# EAGLE design Module_MCU_M5Stack (EAGLE 9.6.2)
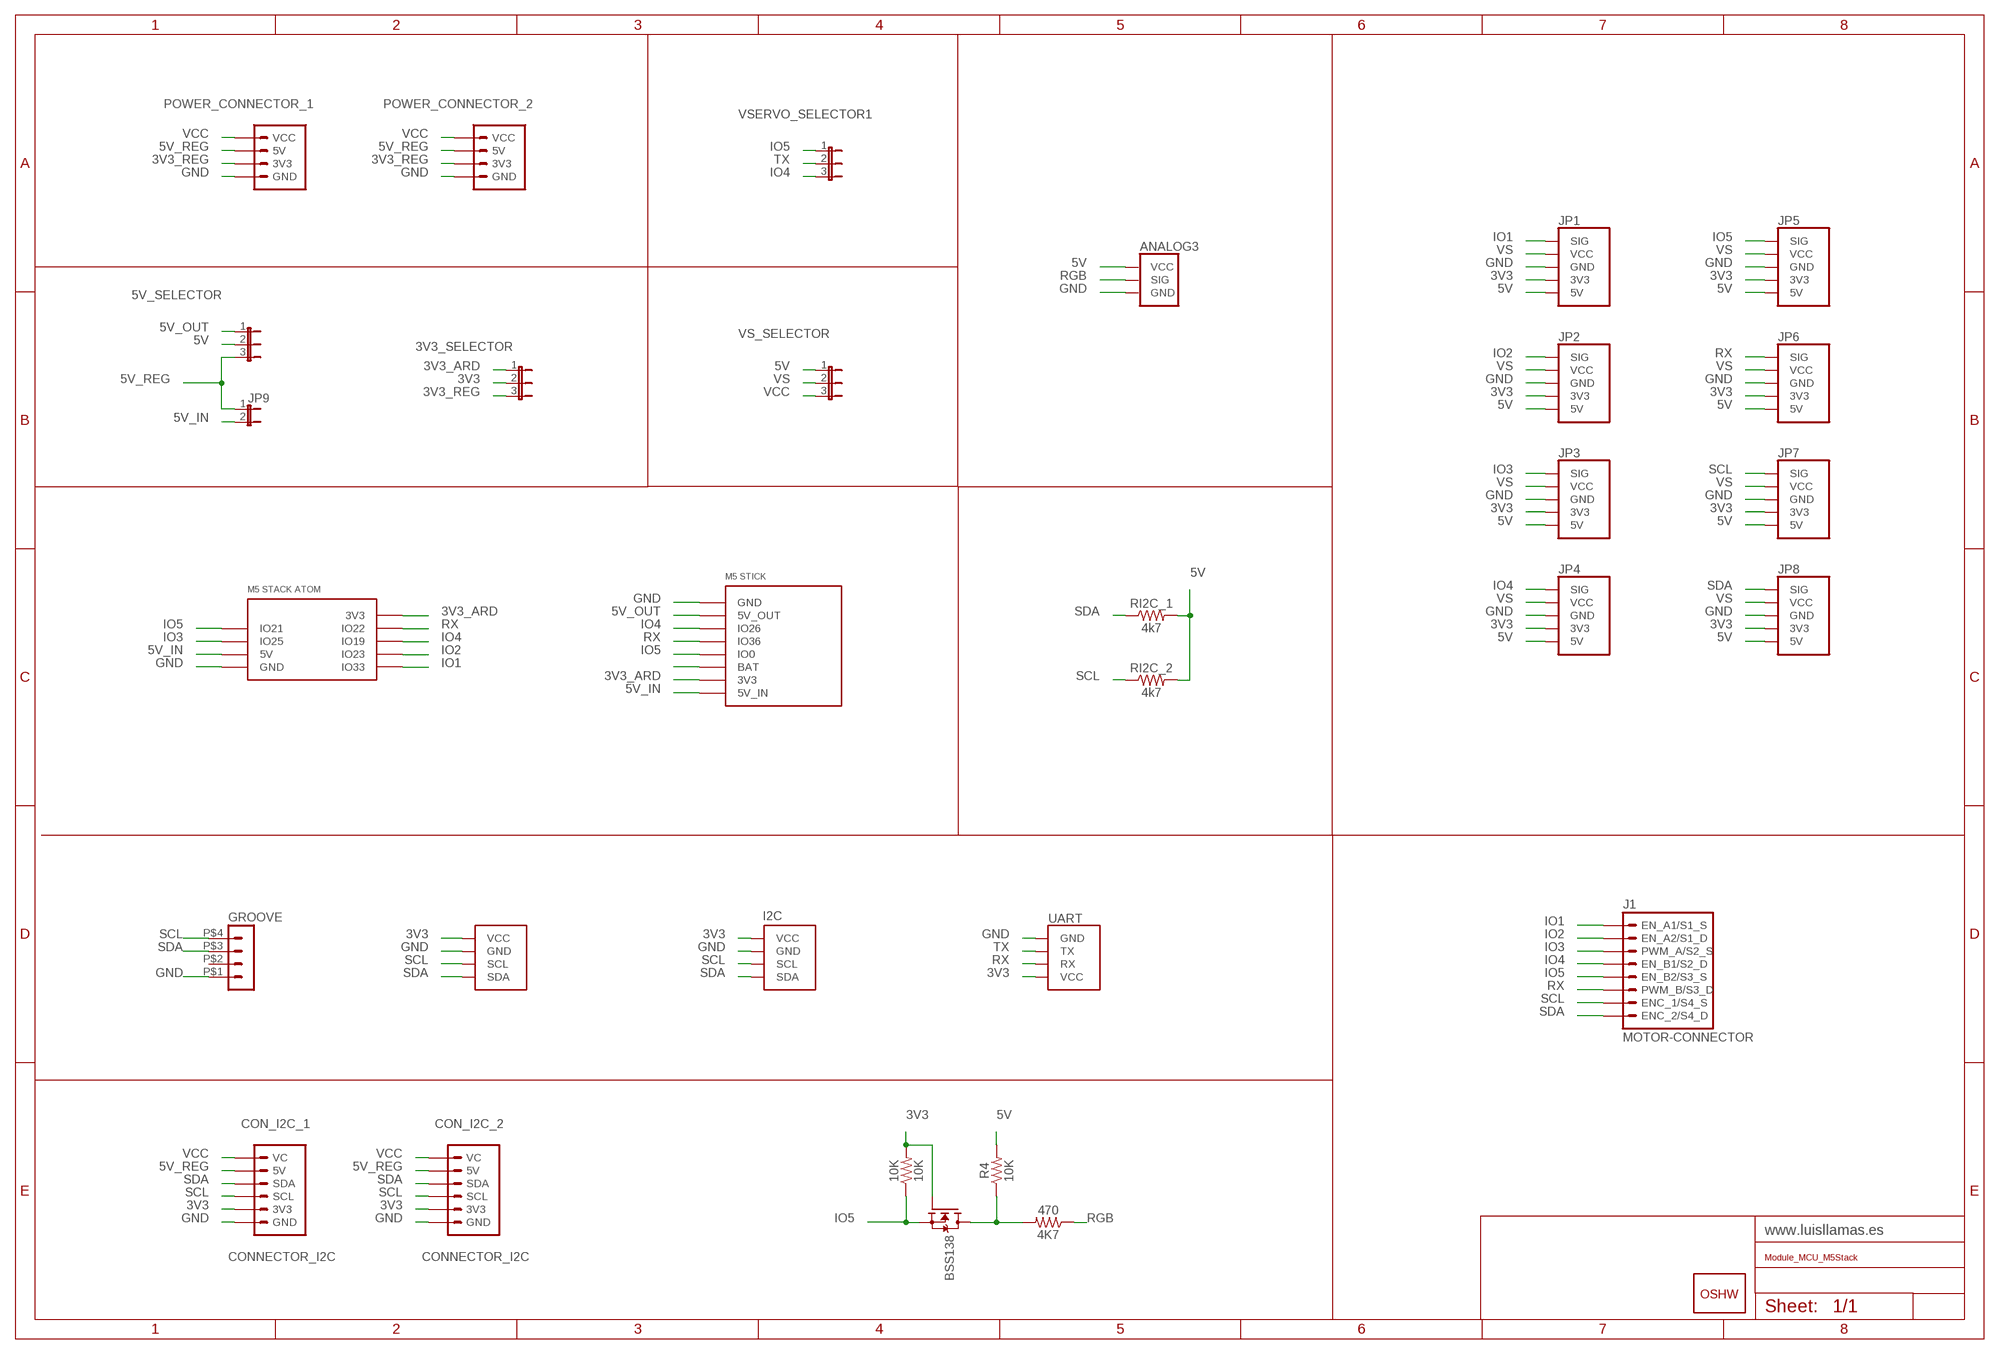
[diagram p0: schematic, sheet 1]

## Parts
3V3_SELECTOR  JUMPER_3  [JUMPER_3]
4K7  470  RESISTOR0805  [0805]
5V_SELECTOR  JUMPER_3  [JUMPER_3]
10K  10K  RESISTOR0805  [0805]
ANALOG3  LDR/OCT  [LDR]
BSS138  MOSFET-N-SOT23  [SOT23]
CON_I2C_1  CONNECTOR_I2C  [CONNECTOR_I2C]
CON_I2C_2  CONNECTOR_I2C  [CONNECTOR_I2C]
GOLD_ORB_SM1  OSHWLOGO_GOLD_ORB_MED  [OSHW1]
GROOVE  GROOVE  [GROOVE]
I2C_1  I2C  GENERIC_I2CVCC_GND_SCL_SDA  [I2C_VCC_GND_SCL_SDA]
I2C_2  GENERIC_I2CVCC_GND_SCL_SDA  [I2C_VCC_GND_SCL_SDA]
J1  MOTOR-CONNECTOR  [MOTOR-CONNECTOR]
JP1  SERVO_5  [SERVO_5]
JP2  SERVO_5  [SERVO_5]
JP3  SERVO_5  [SERVO_5]
JP4  SERVO_5  [SERVO_5]
JP5  SERVO_5  [SERVO_5]
JP6  SERVO_5  [SERVO_5]
JP7  SERVO_5  [SERVO_5]
JP8  SERVO_5  [SERVO_5]
JP9  JUMPER_2PTH  [JUMPER_2]
POWER_CONNECTOR_1  POWER-CONNECTOR  [POWER-CONNECTOR]
POWER_CONNECTOR_2  POWER-CONNECTOR  [POWER-CONNECTOR]
R4  10K  RESISTOR0805  [0805]
RI2C_1  4k7  RESISTOR1206  [1206]
RI2C_2  4k7  RESISTOR1206  [1206]
U$1  M5-STACK-ATOM  [M5-STACK-ATOM]
U$2  M5-STICK  [M5-STICK]
UART  UART  GENERIC_UARTGND_TX_RX_VCC  [GENERIC_UART]
VS_SELECTOR  JUMPER_3  [JUMPER_3]
VSERVO_SELECTOR1  JUMPER_3  [JUMPER_3]

## Nets
3V3: 3V3_SELECTOR.2 10K.2 BSS138.1(G) CON_I2C_1.3V3 CON_I2C_2.3V3 I2C_1.VCC I2C_2.VCC JP1.3V3 JP2.3V3 JP3.3V3 JP4.3V3 JP5.3V3 JP6.3V3 JP7.3V3 JP8.3V3 UART.VCC
3V3_ARD: 3V3_SELECTOR.1 U$1.3V3 U$2.3V3
3V3_REG: 3V3_SELECTOR.3 POWER_CONNECTOR_1.3V3 POWER_CONNECTOR_2.3V3
5V: 5V_SELECTOR.2 ANALOG3.VCC JP1.5V JP2.5V JP3.5V JP4.5V JP5.5V JP6.5V JP7.5V JP8.5V R4.2 RI2C_1.2 RI2C_2.2 VS_SELECTOR.1
5V_IN: JP9.2 U$1.5V U$2.5V_IN
5V_OUT: 5V_SELECTOR.1 U$2.5V_OUT
5V_REG: 5V_SELECTOR.3 CON_I2C_1.5V CON_I2C_2.5V JP9.1 POWER_CONNECTOR_1.5V POWER_CONNECTOR_2.5V
GND: ANALOG3.GND CON_I2C_1.GND CON_I2C_2.GND GROOVE.P$1 I2C_1.GND I2C_2.GND JP1.GND JP2.GND JP3.GND JP4.GND JP5.GND JP6.GND JP7.GND JP8.GND POWER_CONNECTOR_1.GND POWER_CONNECTOR_2.GND U$1.GND U$2.GND UART.GND
IO1: J1.EN_A1/S1_S JP1.SIG U$1.IO33
IO2: J1.EN_A2/S1_D JP2.SIG U$1.IO23
IO3: J1.PWM_A/S2_S JP3.SIG U$1.IO25
IO4: J1.EN_B1/S2_D JP4.SIG U$1.IO19 U$2.IO26 VSERVO_SELECTOR1.3
IO5: 10K.1 BSS138.2(S) J1.EN_B2/S3_S JP5.SIG U$1.IO21 U$2.IO0 VSERVO_SELECTOR1.1
N$9: 4K7.2 BSS138.3(D) R4.1
N$15: U$2.BAT
RGB: 4K7.1 ANALOG3.SIG
RX: J1.PWM_B/S3_D JP6.SIG U$1.IO22 U$2.IO36 UART.RX
SCL: CON_I2C_1.SCL CON_I2C_2.SCL GROOVE.P$4 I2C_1.SCL I2C_2.SCL J1.ENC_1/S4_S JP7.SIG RI2C_2.1
SDA: CON_I2C_1.SDA CON_I2C_2.SDA GROOVE.P$3 I2C_1.SDA I2C_2.SDA J1.ENC_2/S4_D JP8.SIG RI2C_1.1
TX: UART.TX VSERVO_SELECTOR1.2
VCC: CON_I2C_1.VC CON_I2C_2.VC POWER_CONNECTOR_1.VCC POWER_CONNECTOR_2.VCC VS_SELECTOR.3
VS: JP1.VCC JP2.VCC JP3.VCC JP4.VCC JP5.VCC JP6.VCC JP7.VCC JP8.VCC VS_SELECTOR.2
Unconnected: GROOVE.P$2

## Library data of the parts
3V3_SELECTOR 5V_SELECTOR VS_SELECTOR VSERVO_SELECTOR1 = LLL_Jumpers:JUMPER_3
4K7 10K R4 RI2C_1 RI2C_2 = SparkFun-Resistors:RESISTOR: Generic Resistor Package
ANALOG3 = LLL_Headers:LDR: Header for LDR
BSS138 = we-transistor:MOSFET-N: N-Channel MOSFET SOT23 N-Chn MOSFET TSM3404, TSM240N03 (Vgs>=+/-20V, Vds<=30V, Id>=3A + Rds<=0.05Ohm @ Vgs=4.5V) BSS138 (Vgs>=+/-20V, Vds<=40V, Id>=0.2A + Rds<=3Ohm @ Vgs=4.5V) SOT223 Low Side Switch with Protection (Infineon) BSP76 (Vin=0...10V, Vds<=42V, Id=1.4A + Rds=0.2Ohm @ Vin=5V) BSP77 (Vin=0...10V, Vds<=42V, Id=2.2A + Rds=0.1Ohm @ Vin=5V) D²Pak Low Side Switch with Protection (Infineon) BTS117TC (Vin=0...10V, Vds<=60V, Id=3.5A + Rds=0.12Ohm @ Vin=5V) BTS133TC (Vin=0...10V, Vds<=60V, Id=7A + Rds=0.06Ohm @ Vin=5V) BTS141TC (Vin=0...10V, Vds<=60V, Id=12A + Rds=0.03Ohm @ Vin=5V) BTS3018TC (Vin=0...10V, Vds<=60V, Id=6A + Rds=0.02Ohm @ Vin=5V)
CON_I2C_1 CON_I2C_2 = LLL_Connectors:CONNECTOR_I2C
GOLD_ORB_SM1 = LLL_Frames:OSHWLOGO: These are Open-Source Hardware logos.
GROOVE = LLL_Connectors:GROOVE: JST Connector
I2C_1 I2C_2 = LLL_Headers:GENERIC_I2C
J1 = LLL_Motors:MOTOR-CONNECTOR: MOTOR CONNECTOR 8p DC Motor EN_A1 EN_A2 PWM_A EN_B1 EN_B2 PWM_B ENC_1 ENC_2 Stepper STEP1_S STEP1_D STEP2_S STEP2_D STEP3_S STEP3_D STEP4_S STEP4_D
JP1-JP8 = LLL_Headers:SERVO_5: Header for servo
JP9 = LLL_Jumpers:JUMPER_2: Jumper Basic 0.1" spaced jumper. Use with breakaway headers.
POWER_CONNECTOR_1 POWER_CONNECTOR_2 = LLL_Power:POWER-CONNECTOR: JST Connector
U$1 = LLL_ESP32:M5-STACK-ATOM
U$2 = LLL_ESP32:M5-STICK
UART = LLL_Headers:GENERIC_UART

## Net classes
0 default: clearance 0.205 mm

## Board
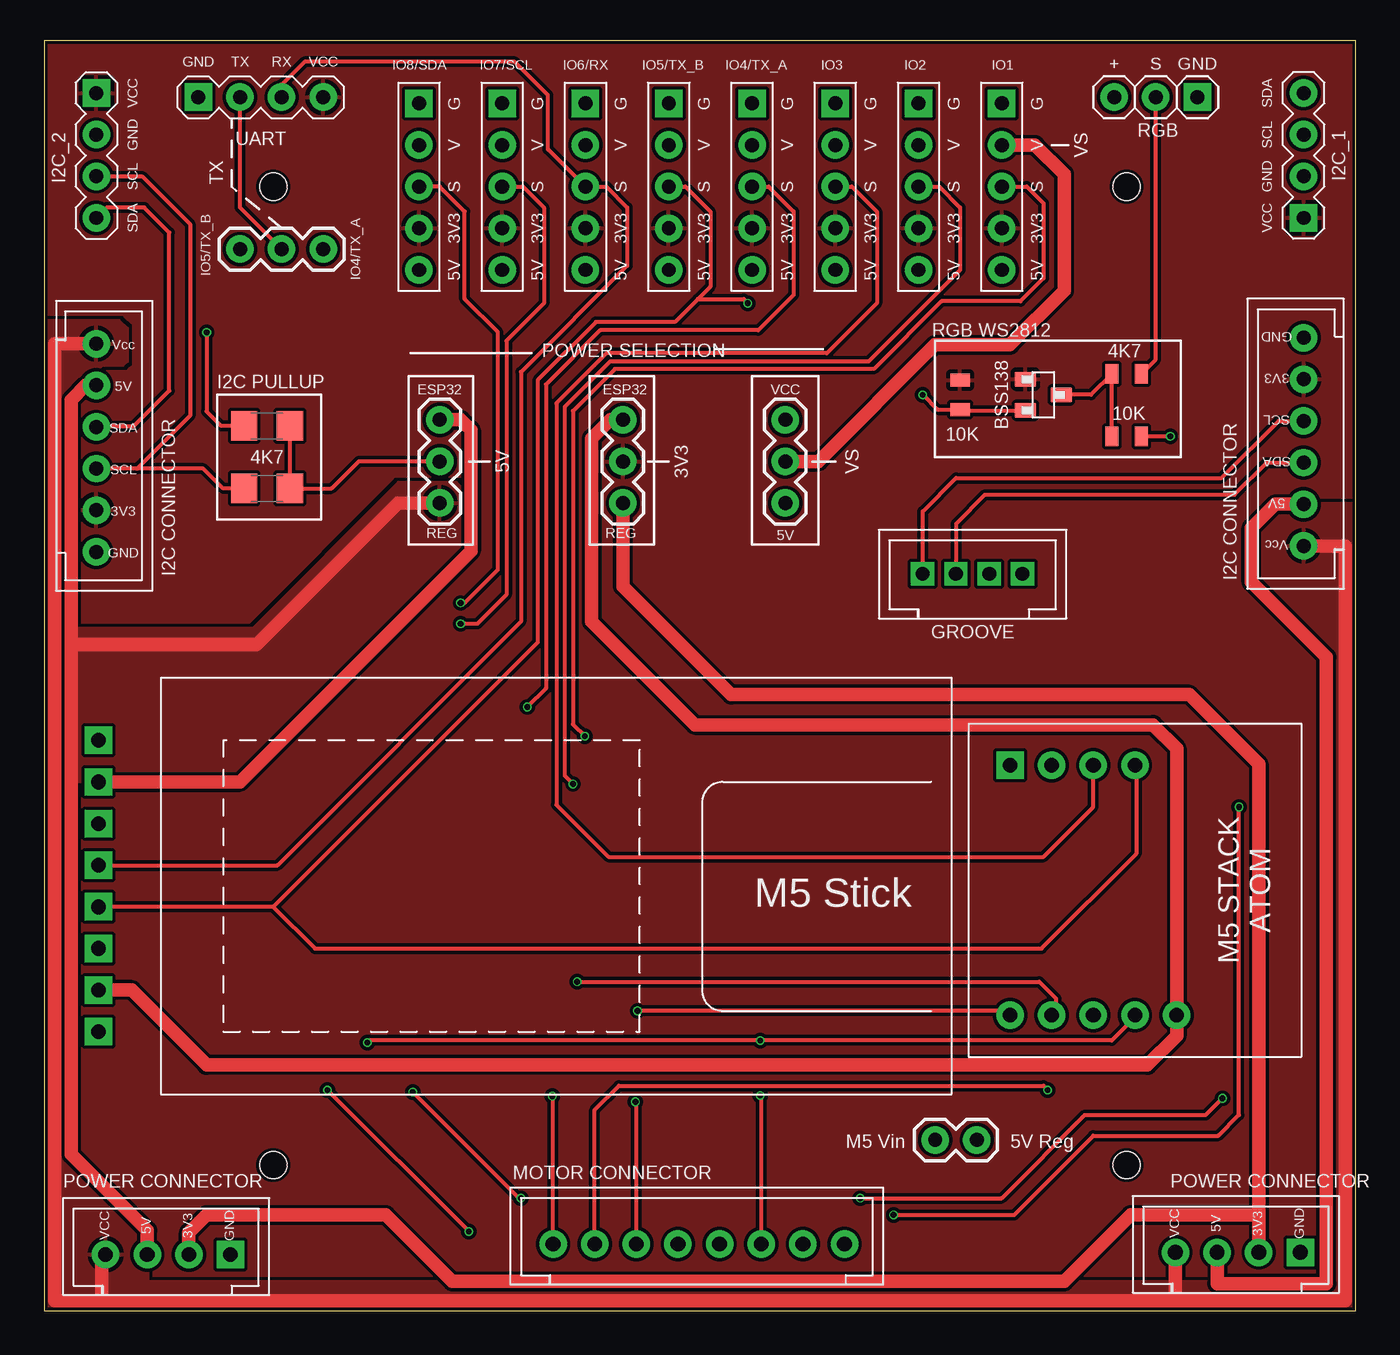
[diagram p1: board, top side]
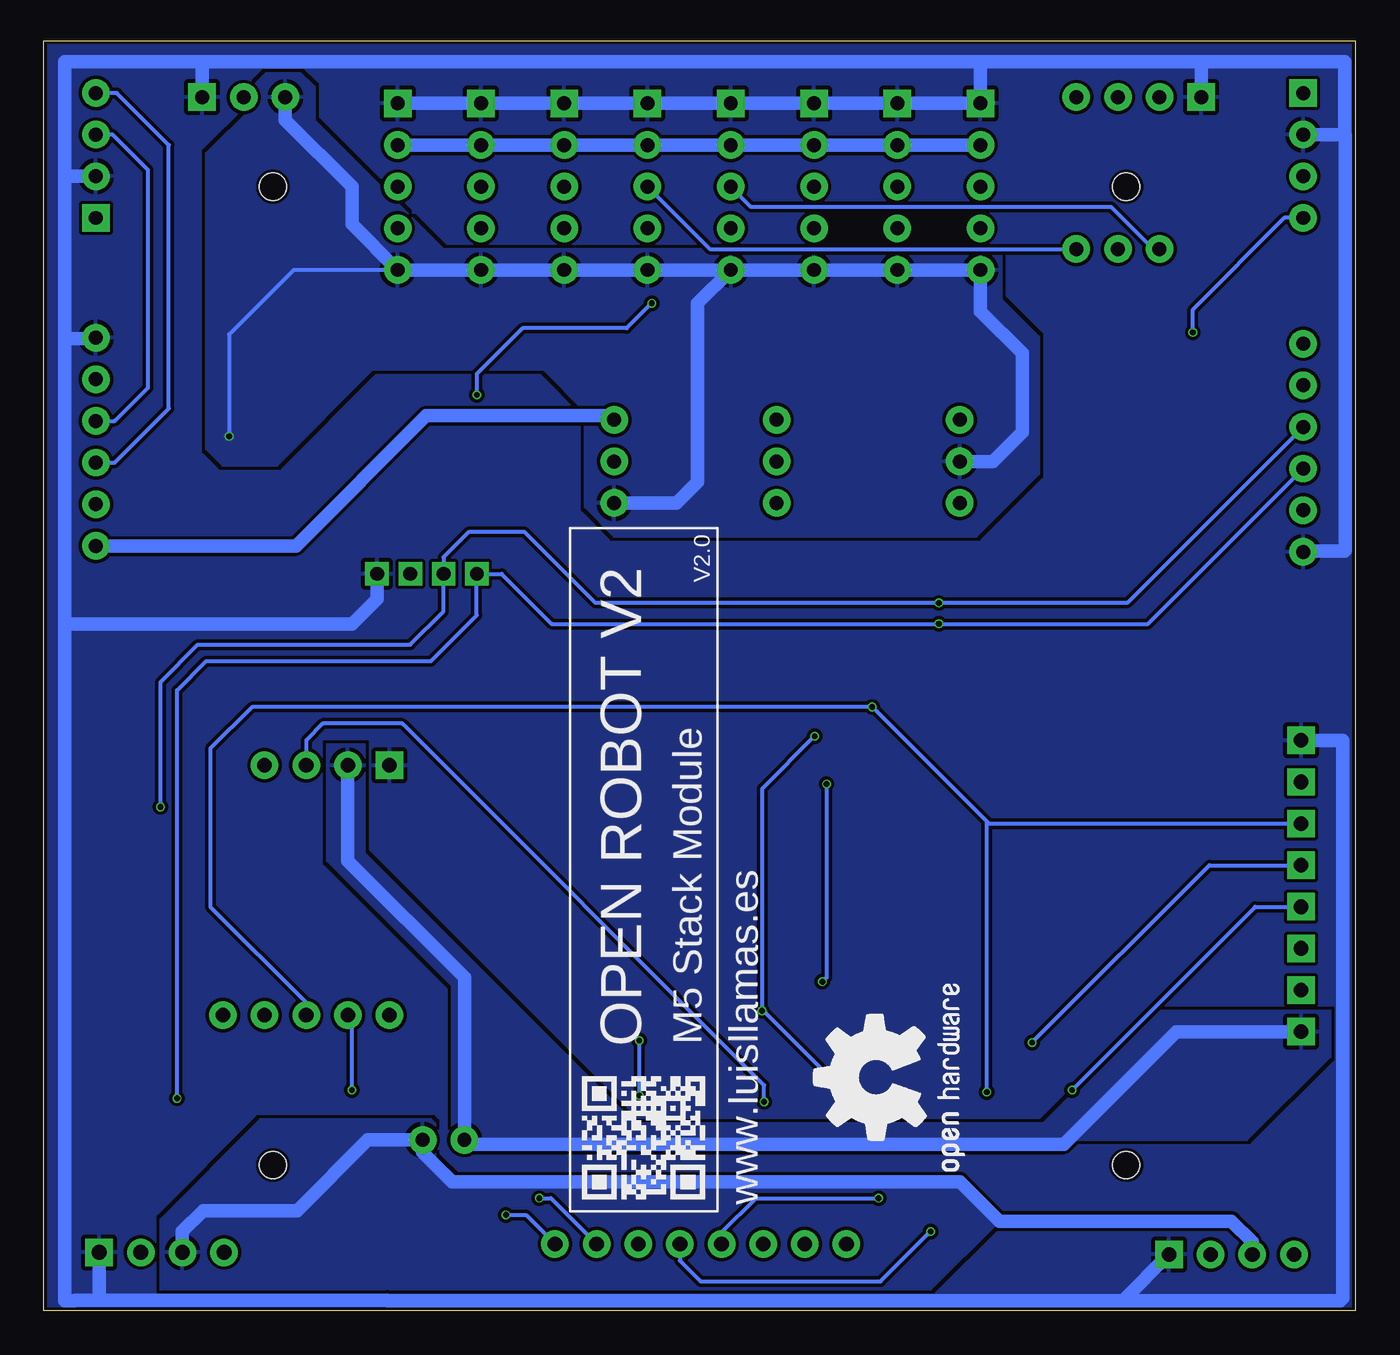
[diagram p2: board, bottom side, seen from below]

Size 80.01 x 77.47 mm. Coordinates in mm from the lower left corner, seen from the top.
Outline: 0,77.47 0,0 80.01,0 80.01,77.47 0,77.47
Copper layers (1*16): Top 0.035559375mm / dielectric 1.6mm / Bottom 0.035559375mm
Design rules "jlcpcb2layer": minimum track width 5mil, minimum drill 12mil, track to track 5mil, track to pad 5mil, pad to pad 5mil, via to via 5mil, smd to smd 5mil, copper to edge 8mil, drill to drill 6mil, minimum pad ring 5mil, minimum via ring 3mil, stop-mask expansion 2.5mil, vias tented up to drill 0mil, thermal gap 10mil
Holes 1.65 mm at 13.97,68.58 13.97,8.89 66.04,68.58 66.04,8.89

### Footprints (pad centres in the part's own frame; a part is rotated, then mirrored left to right if it is on the bottom)
JUMPER_3 = drill 0.85 pad 1.676: 1 0,0; 2 2.54,0; 3 5.08,0
0805 = smd 0.8 x 1.2: 1 -0.9,0; 2 0.9,0
LDR = drill 0.85 pad 1.676 square: GND 0,0 | drill 0.85 pad 1.676: SIG 2.54,0; VCC 5.08,0
SOT23 = smd 1.3 x 0.9: 1 -1.1,0.95; 2 -1.1,-0.95; 3 1.1,0
CONNECTOR_I2C = drill 0.85 pad 1.676: 3V3 0,3.866; 5V 0,-3.754; GND 0,6.406; SCL 0,1.326; SDA 0,-1.214; VC 0,-6.294
GROOVE = drill 0.85 pad 1.422 square: P$1 -1.016,3.048; P$2 -1.016,1.016; P$3 -1.016,-1.016; P$4 -1.016,-3.048
I2C_VCC_GND_SCL_SDA = drill 0.85 pad 1.676: GND 2.54,0; SCL 5.08,0; SDA 7.62,0 | drill 0.85 pad 1.676 square: VCC 0,0
MOTOR-CONNECTOR = drill 0.9 pad 1.676: EN_A1/S1_S 0,-8.834; EN_A2/S1_D 0,-6.294; EN_B1/S2_D 0,-1.214; EN_B2/S3_S 0,1.326; ENC_1/S4_S 0,6.406; ENC_2/S4_D 0,8.946; PWM_A/S2_S 0,-3.754; PWM_B/S3_D 0,3.866
SERVO_5 = drill 0.85 pad 1.676: 3V3 5.08,0; 5V 7.62,0; SIG 2.54,0; VCC 0,0 | drill 0.85 pad 1.676 square: GND -2.54,0
JUMPER_2 = drill 0.85 pad 1.676: 1 0,0; 2 2.54,0
POWER-CONNECTOR = drill 0.9 pad 1.676: 3V3 0,1.326; 5V 0,-1.214; VCC 0,-3.754 | drill 0.9 pad 1.676 square: GND 0,3.866
1206 = smd 1.6 x 1.8: 1 -1.4,0; 2 1.4,0
M5-STACK-ATOM = drill 0.9 pad 1.676: 3V3 7.62,5.08; 5V -7.62,-2.54; IO19 7.62,0; IO21 -7.62,2.54; IO22 7.62,2.54; IO23 7.62,-2.54; IO25 -7.62,0; IO33 7.62,-5.08 | drill 0.9 pad 1.676 square: GND -7.62,-5.08
M5-STICK = drill 0.9 pad 1.676 square: 3V3 -20.32,-6.35; 5V_IN -20.32,-8.89; 5V_OUT -20.32,6.35; BAT -20.32,-3.81; GND -20.32,8.89; IO0 -20.32,-1.27; IO26 -20.32,3.81; IO36 -20.32,1.27
GENERIC_UART = drill 0.85 pad 1.676 square: GND 0,0 | drill 0.85 pad 1.676: RX 5.08,0; TX 2.54,0; VCC 7.62,0

### Placement (x,y rotation side)
3V3_SELECTOR  35.31,54.36 270 top
4K7  66.04,57.15 180 top
5V_SELECTOR  24.13,54.36 270 top
10K  55.88,55.88 90 top
ANALOG3  70.36,74.04 180 top
BSS138  60.96,55.88 0 top
CON_I2C_1  76.83,52.96 0 top
CON_I2C_2  3.17,52.7 180 top
GOLD_ORB_SM1  22.1,7.87 90 bottom
GROOVE  56.64,43.94 270 top
I2C_1  76.83,66.67 90 top
I2C_2  3.17,74.3 270 top
J1  39.88,4.06 270 top
JP1  58.42,71.12 270 top
JP2  53.34,71.12 270 top
JP3  48.26,71.12 270 top
JP4  43.18,71.12 270 top
JP5  38.1,71.12 270 top
JP6  33.02,71.12 270 top
JP7  27.94,71.12 270 top
JP8  22.86,71.12 270 top
JP9  56.9,10.41 180 top
POWER_CONNECTOR_1  7.49,3.43 270 top
POWER_CONNECTOR_2  72.77,3.56 270 top
R4  66.04,53.34 0 top
RI2C_1  13.59,53.98 0 top
RI2C_2  13.59,50.16 0 top
U$1  64.01,25.65 270 top
U$2  23.62,25.91 0 top
UART  9.4,74.04 0 top
VS_SELECTOR  45.21,49.28 90 top
VSERVO_SELECTOR1  11.94,64.77 0 top

### Tracks (layer width: path | path; a pad name or v marks a point on that pad's centre or on a via)
3V3
  pour Top (rank 2): 0,0 0,77.47 80.01,77.47 80.01,0
3V3_ARD
  Top 0.813: 3V3_SELECTOR.1 34.54,54.36 33.4,53.21 33.4,42.04 39.7,35.74 67.64,35.74 69.09,34.29 U$1.3V3 69.09,16.76 67.31,14.99 9.91,14.99 5.33,19.56 U$2.3V3
3V3_REG
  Top 0.813: POWER_CONNECTOR_1.3V3 8.82,4.75 9.91,5.84 20.83,5.84 24.89,1.78 62.23,1.78 66.29,5.84 74.1,5.84 | 74.1,5.84 74.1,33.34 69.85,37.59 41.91,37.59 35.31,44.2 3V3_SELECTOR.3 | 74.1,5.84 POWER_CONNECTOR_2.3V3
5V  (via drill 0.35)
  Top 0.254: RI2C_1.2 RI2C_2.2 17.53,50.16 19.18,51.82 5V_SELECTOR.2 | v68.71,53.34 R4.2
  Bottom 0.254: v68.71,53.34 68.71,59.56 64.77,63.5 JP1.5V
  Bottom 0.813: JP5.5V JP6.5V JP7.5V JP8.5V 22.86,60.96 20.32,58.42 20.32,53.59 22.1,51.82 5V_SELECTOR.2 | JP5.5V JP4.5V JP3.5V JP2.5V JP1.5V 61.21,66.29 61.21,68.58 65.28,72.64 ANALOG3.VCC | VS_SELECTOR.1 41.4,49.28 40.13,50.55 40.13,61.47 JP5.5V
  pour Bottom: 23.11,47.24 45.21,47.24 46.99,49.02 46.99,54.86 49.53,57.4 59.94,57.4 65.79,51.56 69.09,51.56 70.1,52.58 70.1,70.61 67.31,73.41 67.31,74.68 66.29,75.69 64.52,75.69 63.5,74.68 63.5,72.64 55.63,64.77 21.59,64.77 21.59,61.72 19.3,59.44 19.3,51.05
5V_IN
  Bottom 0.813: U$2.5V_IN 10.92,17.02 17.78,10.16 54.1,10.16 JP9.2 54.36,20.32 61.47,27.43 U$1.5V
  pour Bottom: 60.45,34.54 60.45,27.94 43.94,11.43 19.05,11.43 12.19,18.29 1.52,18.29 1.52,15.49 6.6,10.41 55.12,10.41 55.12,19.81 62.74,27.43 62.74,34.54
5V_OUT
  Top 0.813: U$2.5V_OUT 11.94,32.26 26.04,46.35 26.04,53.72 25.4,54.36 5V_SELECTOR.1
5V_REG
  Top 0.813: POWER_CONNECTOR_2.5V 71.56,1.65 78.23,1.65 78.23,39.88 73.66,44.45 73.66,47.75 75.11,49.2 CON_I2C_1.5V | POWER_CONNECTOR_1.5V 6.28,4.9 1.65,9.53 1.65,40.64 | CON_I2C_2.5V 2.54,56.46 1.65,55.57 1.65,40.64 | 1.65,40.64 12.95,40.64 21.59,49.28 5V_SELECTOR.3
  Bottom 0.813: POWER_CONNECTOR_1.5V 6.28,4.19 7.55,5.46 21.72,5.46 24.13,7.87 55.12,7.87 56.9,9.65 JP9.1 60.25,10.41 64.57,6.1 70.29,6.1 71.56,4.83 POWER_CONNECTOR_2.5V
  pour Top: 2.03,41.66 2.03,32.26 11.68,32.26 25.91,46.48 25.91,49.78 25.15,50.55 21.59,50.55 12.7,41.66
  pour Bottom: 24.51,8 54.36,7.88 54.62,7.88 56.13,9.4 56.13,11.43 56.39,11.68 66.8,11.68 72.9,5.59 72.9,1.27 25.91,1.27 21.84,5.33
GND
  Bottom 0.813: POWER_CONNECTOR_1.GND 14.18,0.61 | POWER_CONNECTOR_2.GND 76.64,0.76 76.51,0.64 | 76.51,0.64 59.05,0.64 59.03,0.61 14.18,0.61 | 76.51,0.64 78.11,0.64 78.13,0.61 78.74,0.61 78.74,41.91 | 78.74,41.91 78.74,59.31 | CON_I2C_1.GND 76.89,59.31 78.74,59.31 | 78.74,69.22 I2C_1.GND | 78.74,69.22 78.74,76.2 70.36,76.2 | GROOVE.P$1 59.69,43.43 61.21,41.91 78.74,41.91 | I2C_2.GND 0.64,71.75 | 0.64,71.75 0.61,71.73 0.61,46.38 0.64,46.35 3.12,46.35 CON_I2C_2.GND | 0.64,71.75 0.64,76.2 9.4,76.2 | 9.4,76.2 22.86,76.2 | 22.86,76.2 70.36,76.2 | UART.GND 9.4,76.2 | ANALOG3.GND 70.36,76.2 | 22.86,76.2 JP8.GND JP7.GND JP6.GND JP5.GND JP4.GND JP3.GND JP2.GND JP1.GND | U$2.GND 0.76,34.8 0.76,0.76 0.91,0.61 14.18,0.61 | 78.74,59.31 78.74,69.22
  pour Bottom (rank 2): 0,0 0,77.47 80.01,77.47 80.01,0
IO1  (via drill 0.35)
  Top 0.254: JP1.SIG 59.94,68.58 60.96,67.56 60.96,62.99 59.56,61.59 54.75,61.59 50.61,57.45 34.82,57.45 32.26,54.89 32.26,35.77 v32.98,35.05 | U$1.IO33 58.67,18.29 v36.2,18.29 | J1.EN_A1/S1_S 31.04,13.03 v30.99,13.08
  Bottom 0.254: v32.98,35.05 36.2,31.84 v36.2,18.29 36.2,18.37 30.99,13.16 v30.99,13.08
IO2  (via drill 0.35)
  Top 0.254: JP2.SIG 54.61,68.58 55.88,67.31 55.88,63.5 50.29,57.91 34.53,57.91 31.75,55.13 31.75,32.64 v32.26,32.13 | v32.51,20.07 60.71,20.07 61.72,19.05 61.72,18.29 U$1.IO23 | J1.EN_A2/S1_D 33.58,12.25 35.05,13.72 60.96,13.72 v61.21,13.46
  Bottom 0.254: v32.26,32.13 32.26,20.32 v32.51,20.07 | v61.21,13.46 61.21,17.78 U$1.IO23
IO3  (via drill 0.35)
  Top 0.254: JP3.SIG 49.28,68.58 50.8,67.06 50.8,61.47 47.75,58.42 34.29,58.42 31.24,55.37 31.24,30.86 34.42,27.69 60.96,27.69 64.01,30.73 U$1.IO25 | J1.PWM_A/S2_S 36.12,12.74 v36.07,12.74
  Bottom 0.254: v36.07,12.74 36.07,13.76 58.13,35.81 62.99,35.81 64.01,34.8 U$1.IO25
IO4  (via drill 0.35)
  Top 0.254: JP4.SIG 44.2,68.58 45.72,67.06 45.72,61.98 43.56,59.82 33.91,59.82 30.61,56.52 30.61,37.97 v29.46,36.83 | v29.08,6.86 28.96,6.86 v22.48,13.34
  Bottom 0.254: 22.48,29.84 v29.46,36.83 67.31,36.83 69.85,34.29 69.85,24.64 64.01,18.8 U$1.IO19 | 22.48,29.84 22.35,29.72 U$2.IO26 | JP4.SIG 39.37,64.77 VSERVO_SELECTOR1.3 | J1.EN_B1/S2_D 38.66,4.77 36.58,6.86 v29.08,6.86 | v22.48,13.34 22.48,29.84
IO5  (via drill 0.35)
  Top 0.254: JP5.SIG 39.12,68.58 40.64,67.06 40.64,62.48 39.88,61.72 | 39.88,61.72 38.48,60.33 33.66,60.33 30.1,56.77 30.1,40.77 13.97,24.64 | 13.97,24.64 U$2.IO0 | 13.97,24.64 16.51,22.1 60.85,22.1 66.63,27.88 66.63,33.2 U$1.IO21 | BSS138.2 55.93,54.93 10K.1 54.49,54.98 v53.59,55.88 | 39.88,61.72 42.67,61.72 v42.93,61.47 | v25.91,4.83 v17.27,13.46
  Bottom 0.254: VSERVO_SELECTOR1.1 12.32,64.77 14.89,67.34 36.86,67.34 JP5.SIG | v42.93,61.47 44.45,59.94 50.8,59.94 53.59,57.15 v53.59,55.88 | J1.EN_B2/S3_S 41.2,3.05 39.93,1.78 28.96,1.78 v25.91,4.83 | v17.27,13.46 6.1,24.64 U$2.IO0
N$9
  Top 0.254: R4.1 4K7.2 63.87,55.88 BSS138.3
RGB
  Top 0.254: 4K7.1 67.82,58.03 ANALOG3.SIG
RX  (via drill 0.35)
  Top 0.254: U$2.IO36 14.22,27.18 29.08,42.04 29.08,57.28 35.56,63.75 35.56,67.31 34.29,68.58 JP6.SIG 30.73,70.87 30.73,74.17 28.7,76.2 15.88,76.2 14.48,74.8 UART.RX | U$1.IO22 66.55,17.9 65.13,16.48 v43.69,16.48 19.84,16.48 v19.71,16.36 | J1.PWM_B/S3_D 43.74,13.07 v43.69,13.12
  Bottom 0.254: U$2.IO36 8.89,27.18 v19.71,16.36 | v43.69,16.48 v43.69,13.12
SCL  (via drill 0.35)
  Top 0.254: I2C_2.SCL 5.97,69.22 8.89,66.29 8.89,54.61 5.66,51.38 | 5.66,51.38 CON_I2C_2.SCL | GROOVE.P$4 53.59,48.77 55.63,50.8 71.83,50.8 75.31,54.28 CON_I2C_1.SCL | JP7.SIG 29.21,68.58 30.48,67.31 30.48,61.47 28.19,59.18 28.19,43.69 26.42,41.91 v25.4,41.91 | RI2C_2.1 10.92,50.16 9.71,51.38 5.66,51.38 | v49.78,6.86 58.42,6.86 63.5,11.94 70.87,11.94 v71.88,12.95
  Bottom 0.254: CON_I2C_1.SCL 75.69,54.28 73.66,56.32 73.66,69.6 75.82,71.75 I2C_1.SCL | CON_I2C_2.SCL 12.64,41.91 v25.4,41.91 49.02,41.91 52.07,44.96 GROOVE.P$4 53.59,42.42 56.39,39.62 70.1,39.62 71.88,37.85 v71.88,12.95 | v49.78,6.86 49.08,6.86 J1.ENC_1/S4_S
SDA  (via drill 0.35)
  Top 0.254: CON_I2C_2.SDA 3.23,53.98 5.46,53.98 7.62,56.13 7.62,65.79 6.1,67.31 3.81,67.31 I2C_2.SDA | GROOVE.P$3 55.63,48.01 57.4,49.78 72.62,49.78 74.58,51.74 CON_I2C_1.SDA | v25.4,43.18 25.65,43.18 27.69,45.21 27.69,59.69 25.65,61.72 25.65,67.06 24.13,68.58 JP8.SIG | v9.91,59.69 9.91,54.86 10.79,53.98 RI2C_1.1 | v51.82,5.84 59.18,5.84 64.01,10.67 71.63,10.67 72.9,11.94 v72.9,30.73
  Bottom 0.254: CON_I2C_1.SDA 75.69,51.74 72.39,55.05 72.39,71.12 75.56,74.3 I2C_1.SDA | CON_I2C_2.SDA 13.91,43.18 v25.4,43.18 46.35,43.18 50.67,47.5 54.1,47.5 55.63,45.97 GROOVE.P$3 55.63,42.67 57.66,40.64 70.61,40.64 72.9,38.35 v72.9,30.73 | v9.91,59.69 9.91,61.09 4.32,66.67 I2C_2.SDA | v51.82,5.84 50.6,5.84 J1.ENC_2/S4_D
TX
  Top 0.254: VSERVO_SELECTOR1.2 11.94,67.31 UART.TX
VCC
  Top 0.813: CON_I2C_1.VC 79.38,46.66 79.38,0.61 69.02,0.61 | CON_I2C_2.VC 0.63,59 0.63,0.61 3.51,0.61 | POWER_CONNECTOR_1.VCC 3.51,3.2 3.51,0.61 | POWER_CONNECTOR_2.VCC 69.02,0.61 | 69.02,0.61 3.51,0.61
  Bottom 0.813: VS_SELECTOR.3 45.47,54.61 56.68,54.61 64.62,46.66 CON_I2C_1.VC
  pour Top: 0,60.45 4.57,60.45 5.08,59.94 5.08,57.91 4.83,57.66 3.56,57.66 1.52,55.63 1.52,9.65 6.35,4.83 6.35,1.78 77.72,1.78 78.23,2.29 78.23,39.88 73.66,44.45 73.66,47.5 75.44,49.28 80.01,49.28 80.01,0 0,0
VS
  Top 0.813: VS_SELECTOR.2 47.24,51.82 54.36,58.93 58.93,58.93 62.23,62.23 62.23,69.34 60.45,71.12 JP1.VCC
  Bottom 0.813: JP8.VCC JP7.VCC JP6.VCC JP5.VCC JP4.VCC JP3.VCC JP2.VCC JP1.VCC

### Text on the board
tPlace: IO8/SDA | IO7/SCL | IO6/RX | IO5/TX_B | IO4/TX_A | IO3 | IO2 | IO1 | UART | RGB | VS | I2C_2 | I2C_1 | TX | IO5/TX_B | IO4/TX_A | RGB WS2812 | 4K7 | POWER SELECTION | I2C PULLUP | ESP32 | ESP32 | VCC | 10K | 10K | 4K7 | 5V | 3V3 | VS | REG | REG | 5V | I2C CONNECTOR | I2C CONNECTOR | M5 Vin | 5V Reg | MOTOR CONNECTOR | POWER CONNECTOR | POWER CONNECTOR
bPlace: V2.0 | M5 Stack Module | OPEN ROBOT V2 | www.luisllamas.es